# Altium schematic sheet ADC.SchDoc
size 330 x 220 mm; SheetNumber: 1; SheetTotal: 1
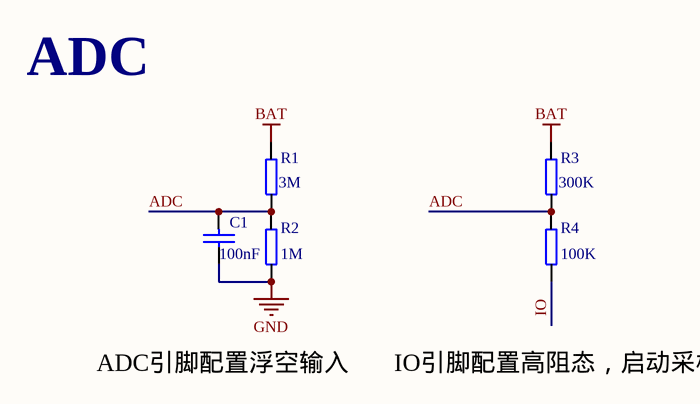
[diagram p0: ADC.SchDoc]

## Parts
C1  100nF  [0402_C]
R1  3M  [0402]
R2  1M  [0402]
R3  300K  [0402]
R4  100K  [0402]

## Nets
BAT: R1.2 R3.2
GND: C1.2 R2.1
ADC: C1.1 R1.1 R2.2 R3.1 R4.2
IO: R4.1

## Notes on the sheet
- ADC
- ADC引脚配置浮空输入
- IO引脚配置高阻态，启动采样时配置输出低

## Library data of the parts
C1 = CAP: Capacitor
R1-R4 = RES